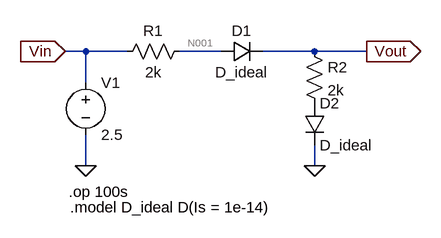
[diagram p0: schematic Prob_2b.asc]
Prob_2b.asc, the LTspice schematic file:
Version 4
SHEET 1 880 680
WIRE 16 16 -16 16
WIRE 80 16 16 16
WIRE 224 16 160 16
WIRE 368 16 288 16
WIRE 448 16 368 16
WIRE 16 64 16 16
WIRE 16 192 16 144
WIRE 368 192 368 160
FLAG 16 192 0
FLAG 368 192 0
FLAG -16 16 Vin
IOPIN -16 16 In
FLAG 448 16 Vout
IOPIN 448 16 Out
SYMBOL voltage 16 48 R0
WINDOW 123 0 0 Left 0
WINDOW 39 0 0 Left 0
SYMATTR InstName V1
SYMATTR Value 2.5
SYMBOL res 176 0 R90
WINDOW 0 0 56 VBottom 2
WINDOW 3 32 56 VTop 2
SYMATTR InstName R1
SYMATTR Value 2k
SYMBOL diode 224 32 R270
WINDOW 0 32 32 VTop 2
WINDOW 3 0 32 VBottom 2
SYMATTR InstName D1
SYMATTR Value D_ideal
SYMATTR SpiceLine temp=300
SYMBOL res 352 0 R0
SYMATTR InstName R2
SYMATTR Value 2k
SYMBOL diode 352 96 R0
SYMATTR InstName D2
SYMATTR Value D_ideal
SYMATTR SpiceLine temp = 300
TEXT -10 232 Left 2 !.op 100s
TEXT -8 256 Left 2 !.model D_ideal D(Is = 1e-14)

The netlist it stands for:
* Prob_2b.asc
V1 Vin 0 2.5
R1 N001 Vin 2k
D1 N001 Vout D_ideal temp=300
R2 Vout P001 2k
D2 P001 0 D_ideal temp = 300
.model D D
.lib standard.dio
.op 100s
.model D_ideal D(Is = 1e-14)
.backanno
.end

* Results of the author's LTspice run, read from the files saved beside the schematic
* Operating Point:
*   V(vin) = 2.5 V
*   V(n001) = 1.372 V
*   V(vout) = 1.25 V
*   V(p001) = 121.7 mV
*   I(D2) = 564.2 µA
*   I(D1) = 564.2 µA
*   I(R2) = 564.2 µA
*   I(R1) = -564.2 µA
*   I(V1) = -564.2 µA
* From the log:
*   Semiconductor Device Operating Points:
*                           --- Diodes ---
*   Name:      d2          d1
*   Model:   d_ideal     d_ideal
*   Id:      5.64e-04    5.64e-04
*   Vd:      1.22e-01    1.22e-01
*   Req:     8.01e+01    8.01e+01
*   CAP:     0.00e+00    0.00e+00